# Altium schematic sheet EthernetPhy.SchDoc
size A
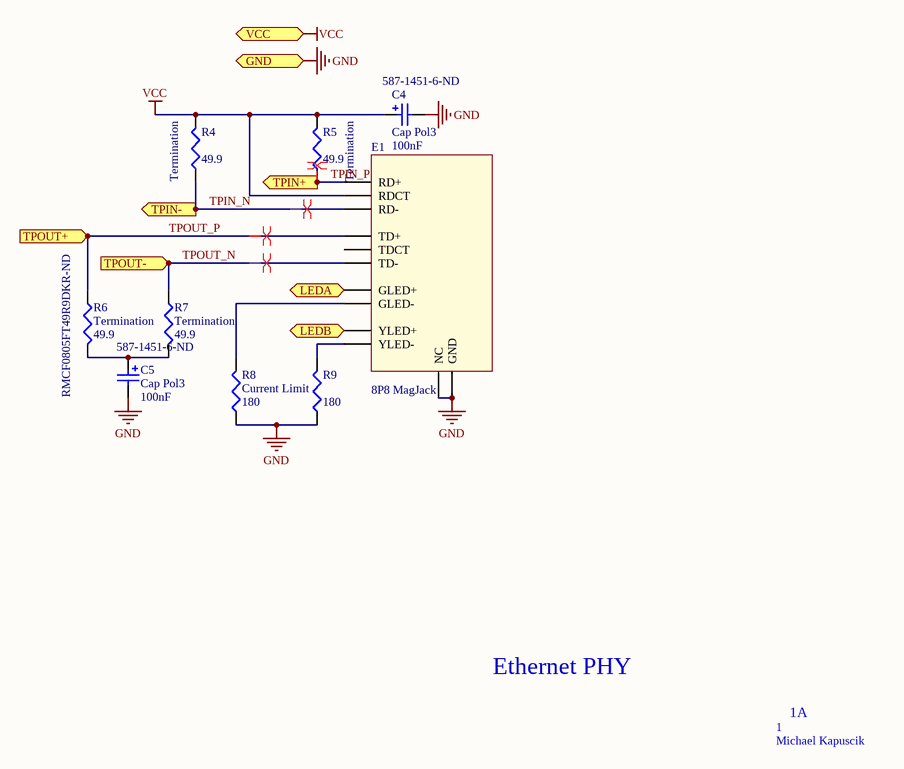
[diagram p0: EthernetPhy.SchDoc]

## Parts
C4  Cap Pol3  value 100nF  Supplier Part Number 1: 587-1451-6-ND  [C0805]
C5  Cap Pol3  value 100nF  Supplier Part Number 1: 587-1451-6-ND  [C0805]
E1  8P8 MagJack  [HR911105]
R4  Termination  value 49.9  [J1-0603]
R5  Termination  value 49.9  [J1-0603]
R6  Termination  value 49.9  Supplier Part Number 1: RMCF0805FT49R9DKR-ND  [J1-0603]
R7  Termination  value 49.9  [J1-0603]
R8  Current Limit  value 180  [J1-0603]
R9  value 180  [J1-0603]  (hidden comment: Current Limit)

## Ports
GND, LEDA (in), LEDB (in), TPIN+ (out), TPIN- (out), TPOUT+ (in), TPOUT- (in), VCC

## Nets
GND: C4.2 C5.2 E1.7(NC) E1.8(GND) R8.1 R9.1 ; port GND
VCC: C4.1 E1.5(RDCT) R4.2 R5.2 ; port VCC
LEDA: E1.9(GLED+) ; port LEDA
LEDB: E1.12(YLED+) ; port LEDB
TPIN_N: E1.6(RD-) R4.1 ; port TPIN-
TPIN_P: E1.3(RD+) R5.1 ; port TPIN+
TPOUT_N: E1.2(TD-) R7.1 ; port TPOUT-
TPOUT_P: E1.1(TD+) R6.1 ; port TPOUT+
NetC5_1: C5.1 R6.2 R7.2
NetE1_10: E1.10(GLED-) R8.2
NetE1_11: E1.11(YLED-) R9.2

Not connected (* = marked no-connect by the designer): E1 4(TDCT)

## Layout directives
differential pair: TPIN_N, TPIN_P, TPOUT_N, TPOUT_P

## Notes on the sheet
- Ethernet PHY
- 1
- 1A
- Michael Kapuscik

## Library data of the parts
C4 C5 = Cap Pol3: Polarized Capacitor (Surface Mount); Manufacturer: Taiyo Yuden; Manufacturer Part Number: EMK105B7104KV-F; Capacitance: 0.1µF; Voltage - Rated: 16V; Tolerance: ±10%; Temperature Coefficient: X7R; Published: 8-Jun-2000; LatestRevisionDate: 29-May-2009; LatestRevisionNote: IPC-7351 Footprint Added.; PackageReference: C0805; Publisher: Altium Limited; PackageDescription: Chip Capacitor; Supplier 1: Digi-Key; RoHS: RoHS Compliant; Category: Capacitors; Stock 1: 550127; Pricing 1: 1=0.1, 10=0.016, 50=0.0084, 100=0.0072, 250=0.00584, 500=0.005, 1000=0.0039, 5000=0.00325 (USD); Packaging: Digi-Reel®; Mounting Type: Surface Mount, MLCC; Operating Temperature: -55°C ~ 125°C; Applications: General Purpose; Ratings: -; Package / Case: 0402 (1005 Metric); Size / Dimension: 0.039" L x 0.020" W (1.00mm x 0.50mm); Height - Seated (Max): -; Thickness (Max): 0.022" (0.55mm); Lead Spacing: -; Features: -; Lead Style: -; ComponentLink1URL: http://www.yuden.co.jp/or/product/category/capacitor/EMK105B7104KV-F.pdf; ComponentLink1Description: http://www.yuden.co.jp/or/product/category/capacitor/EMK105B7104KV-F.pdf
R4-R9 = Res3: Resistor; Published: 8-Jun-2000; LatestRevisionDate: 29-May-2009; LatestRevisionNote: IPC-7351 Footprint Added.; PackageReference: J1-0603; Publisher: Altium Limited; PackageDescription: Chip Resistor
  R4-R7: Supplier 1: Digi-Key